# Altium project ESP32 S3_USB Dongle_V1.0.PrjPcb (part 3 of 3)
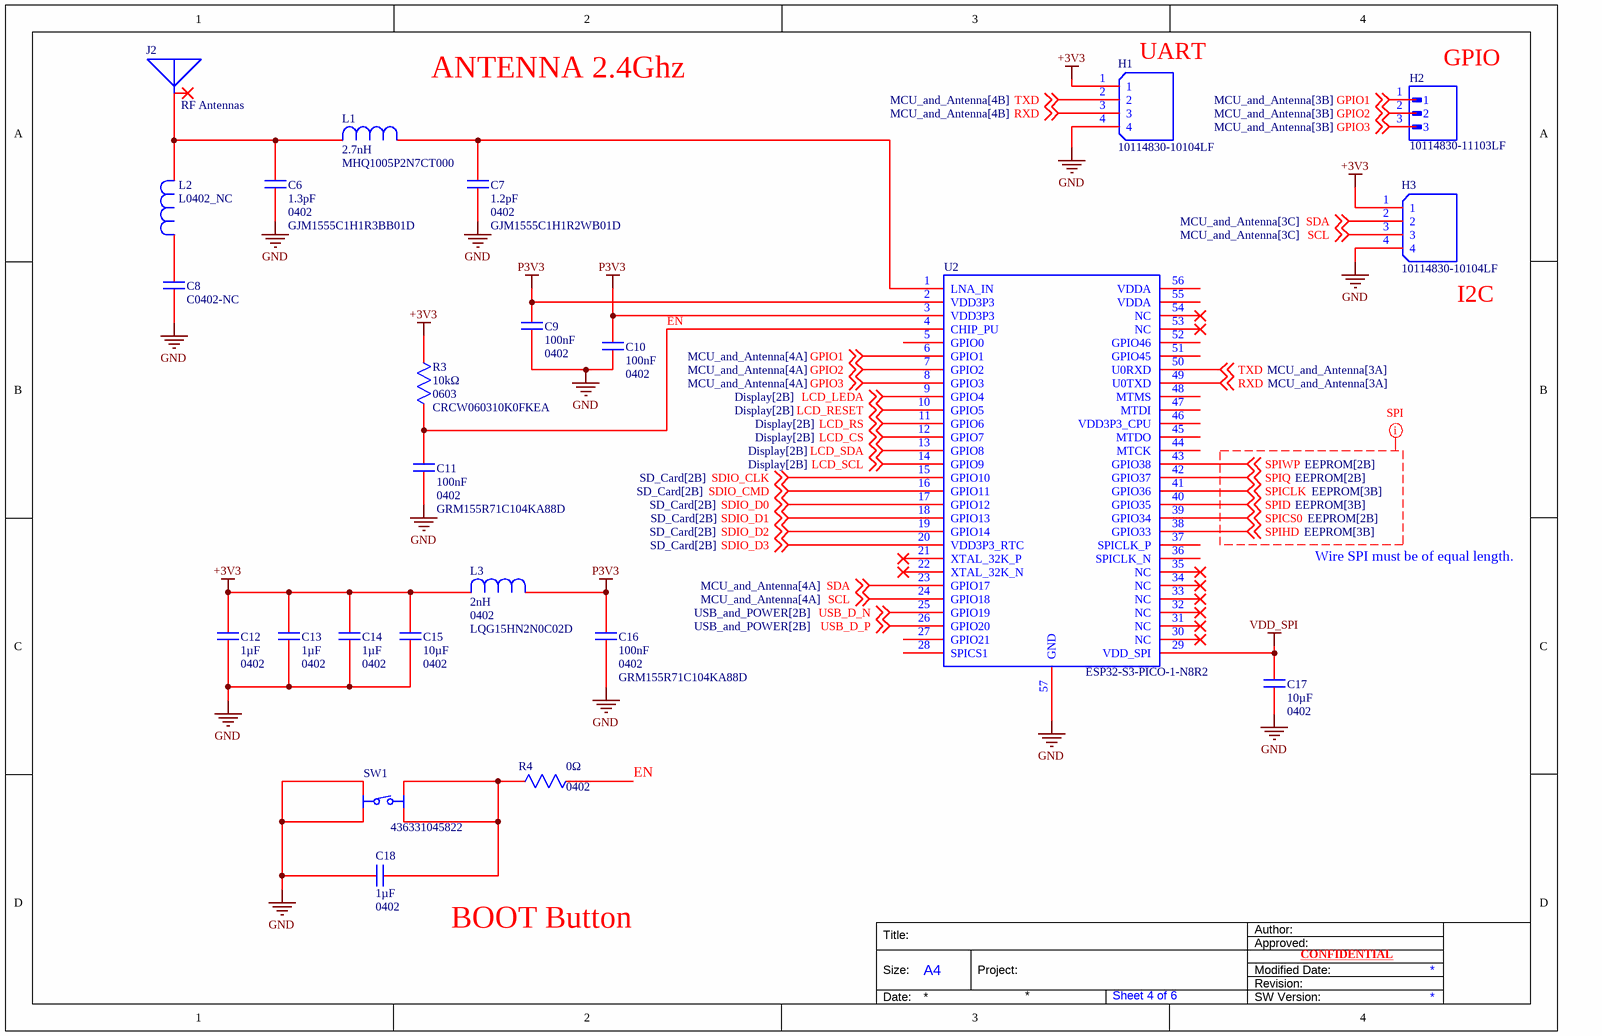
[diagram p6: MCU_and_Antenna.SchDoc]

## Sheet MCU_and_Antenna.SchDoc (continued)

### Library data of the parts (continued)
R3 = CRCW060310K0FKEA: Fixed Resistor, Metal Glaze/Thick Film, 0.1W, 10000ohm, 75V, 1% +/-Tol, Surface Mount, 0603; Manufacturer: Vishay; Max Power Dissipation: 100mW; Temperature Coefficient: 100ppm/°C; Supplier: DigiKey; Supplier Part Number: 541-10.0KHCT-ND; Manufacturer Part Number: CRCW060310K0FKEA; RoHS: Compliant; Category: Chip SMD Resistors; Stock: 5381974; Pricing: 1=0,1, 10=0,032, 25=0,024, 50=0,0194, 100=0,0158, 250=0,0124, 500=0,01046, 1000=0,00893 (USD); Case/Package: 0603; China RoHS: Non-Compliant; Composition: Thick Film; Contact Plating: Lead, Tin; Country of Origin: Israel, Taiwan; Depth: 850µm; Export Control Classification Number (ECCN) Code: EAR99; Features: Automotive AEC-Q200; Height: 450µm; Harmonized Tariff Schedule (HTS) Code: 8533.21.00.30; Introduction Date: 2005-02-16; Lead Free: Lead Free; Length: 1.55mm; Lifecycle Status: Production; Max Operating Temperature: 155°C; Military Standard: Not; Min Operating Temperature: -55°C; Mounting Technology: Surface Mount; Pins: 2; Number of Terminals: 2; Number of Terminations: 2; Packaging: Tape and Reel; Power Rating: 100mW; Radiation Hardening: No; Ratings: AEC-Q200; REACH SVHC: Yes; Schedule B: 8533210045, 8533210045|8533210045|8533210045|8533210045|8533210045|8533210045|8533210045|8533210045|8533210045|8533210045|8533210045|8533210045|8533210045|8533210045|8533210045|8533210045|8533210045|8533210045|8533210045|8533210045|8533210045|8533210045|8533210045|85; Termination: SMD/SMT; Tolerance: 1%; Voltage Rating: 75V; Voltage Rating (DC): 75V; Weight: 2.012816mg; Width: 850µm; Working Voltage: 75V; ComponentLink1URL: https://datasheet.octopart.com:443/CRCW060310K0FKEA-Vishay-datasheet-175423584.pdf?src-supplier=IHS; ComponentLink1Description: https://datasheet.octopart.com:443/CRCW060310K0FKEA-Vishay-datasheet-175423584.pdf?src-supplier=IHS; ComponentLink2URL: https://datasheet.octopart.com:443/CRCW060310K0FKEA-Vishay-datasheet-5300368.pdf?src-supplier=Future+Electronics; ComponentLink2Description: https://datasheet.octopart.com:443/CRCW060310K0FKEA-Vishay-datasheet-5300368.pdf?src-supplier=Future+Electronics; ComponentLink3URL: https://datasheet.octopart.com:443/CRCW060310K0FKEA-Vishay-datasheet-62316122.pdf?src-supplier=Future+Electronics; ComponentLink3Description: https://datasheet.octopart.com:443/CRCW060310K0FKEA-Vishay-datasheet-62316122.pdf?src-supplier=Future+Electronics; ComponentLink4URL: https://datasheet.octopart.com:443/CRCW060310K0FKEA-Vishay-datasheet-141434677.pdf?src-supplier=Upverter; ComponentLink4Description: https://datasheet.octopart.com:443/CRCW060310K0FKEA-Vishay-datasheet-141434677.pdf?src-supplier=Upverter; ComponentLink5URL: https://datasheet.octopart.com:443/CRCW060310K0FKEA-Vishay-datasheet-83961561.pdf?src-supplier=Newark; ComponentLink5Description: https://datasheet.octopart.com:443/CRCW060310K0FKEA-Vishay-datasheet-83961561.pdf?src-supplier=Newark; ComponentLink6URL: https://datasheet.octopart.com:443/CRCW060310K0FKEA-Vishay-datasheet-14722531.pdf?src-supplier=Newark; ComponentLink6Description: https://datasheet.octopart.com:443/CRCW060310K0FKEA-Vishay-datasheet-14722531.pdf?src-supplier=Newark; ComponentLink7URL: https://datasheet.octopart.com:443/CRCW060310K0FKEA-Vishay-datasheet-11516975.pdf?src-supplier=Newark; ComponentLink7Description: https://datasheet.octopart.com:443/CRCW060310K0FKEA-Vishay-datasheet-11516975.pdf?src-supplier=Newark; ComponentLink8URL: https://datasheet.octopart.com:443/CRCW060310K0FKEA-Vishay-datasheet-41302739.pdf?src-supplier=Newark; ComponentLink8Description: https://datasheet.octopart.com:443/CRCW060310K0FKEA-Vishay-datasheet-41302739.pdf?src-supplier=Newark; ComponentLink9URL: https://datasheet.octopart.com:443/CRCW060310K0FKEA-Vishay-datasheet-33013972.pdf?src-supplier=Newark; ComponentLink9Description: https://datasheet.octopart.com:443/CRCW060310K0FKEA-Vishay-datasheet-33013972.pdf?src-supplier=Newark; ComponentLink10URL: https://datasheet.octopart.com:443/CRCW060310K0FKEA-Vishay-datasheet-21226360.pdf?src-supplier=Newark; ComponentLink10Description: https://datasheet.octopart.com:443/CRCW060310K0FKEA-Vishay-datasheet-21226360.pdf?src-supplier=Newark; ComponentLink11URL: https://datasheet.octopart.com:443/CRCW060310K0FKEA-Vishay-datasheet-62317933.pdf?src-supplier=element14+APAC; ComponentLink11Description: https://datasheet.octopart.com:443/CRCW060310K0FKEA-Vishay-datasheet-62317933.pdf?src-supplier=element14+APAC; ComponentLink12URL: https://datasheet.octopart.com:443/CRCW060310K0FKEA-Vishay-datasheet-16179825.pdf?src-supplier=element14+APAC; ComponentLink12Description: https://datasheet.octopart.com:443/CRCW060310K0FKEA-Vishay-datasheet-16179825.pdf?src-supplier=element14+APAC; ComponentLink13URL: https://datasheet.octopart.com:443/CRCW060310K0FKEA-Vishay-datasheet-66077789.pdf?src-supplier=element14+APAC; ComponentLink13Description: https://datasheet.octopart.com:443/CRCW060310K0FKEA-Vishay-datasheet-66077789.pdf?src-supplier=element14+APAC; ComponentLink14URL: https://datasheet.octopart.com:443/CRCW060310K0FKEA-Vishay-datasheet-5306405.pdf?src-supplier=RS+(Formerly+Allied+Electronics); ComponentLink14Description: https://datasheet.octopart.com:443/CRCW060310K0FKEA-Vishay-datasheet-5306405.pdf?src-supplier=RS+(Formerly+Allied+Electronics); ComponentLink15URL: https://datasheet.octopart.com:443/CRCW060310K0FKEA-Vishay-Dale-datasheet-47688880.pdf?src-supplier=RS+(Formerly+Allied+Electronics); ComponentLink15Description: https://datasheet.octopart.com:443/CRCW060310K0FKEA-Vishay-Dale-datasheet-47688880.pdf?src-supplier=RS+(Formerly+Allied+Electronics); ComponentLink16URL: https://datasheet.octopart.com:443/CRCW060310K0FKEA-Vishay-datasheet-12001583.pdf?src-supplier=RS+(Formerly+Allied+Electronics); ComponentLink16Description: https://datasheet.octopart.com:443/CRCW060310K0FKEA-Vishay-datasheet-12001583.pdf?src-supplier=RS+(Formerly+Allied+Electronics); ComponentLink17URL: https://datasheet.octopart.com:443/CRCW060310K0FKEA-Vishay-datasheet-17834126.pdf?src-supplier=TME; ComponentLink17Description: https://datasheet.octopart.com:443/CRCW060310K0FKEA-Vishay-datasheet-17834126.pdf?src-supplier=TME; ComponentLink18URL: https://datasheet.octopart.com/D-CRCW-e3-Standard-Thick-Film-Chip-Resistors-Vishay-datasheet-family-64.pdf; ComponentLink18Description: https://datasheet.octopart.com/D-CRCW-e3-Standard-Thick-Film-Chip-Resistors-Vishay-datasheet-family-64.pdf; ComponentLink19URL: https://datasheet.octopart.com:443/CRCW060310K0FKEA-Vishay-datasheet-13242068.pdf?src-supplier=Farnell; ComponentLink19Description: https://datasheet.octopart.com:443/CRCW060310K0FKEA-Vishay-datasheet-13242068.pdf?src-supplier=Farnell; ComponentLink20URL: https://datasheet.octopart.com:443/CRCW060310K0FKEA-Vishay-datasheet-13195083.pdf?src-supplier=Farnell; ComponentLink20Description: https://datasheet.octopart.com:443/CRCW060310K0FKEA-Vishay-datasheet-13195083.pdf?src-supplier=Farnell; ComponentLink21URL: https://datasheet.octopart.com:443/CRCW060310K0FKEA-Vishay-datasheet-13034211.pdf?src-supplier=Farnell; ComponentLink21Description: https://datasheet.octopart.com:443/CRCW060310K0FKEA-Vishay-datasheet-13034211.pdf?src-supplier=Farnell; ComponentLink22URL: https://datasheet.octopart.com:443/CRCW060310K0FKEA-Vishay-datasheet-12600034.pdf?src-supplier=Farnell; ComponentLink22Description: https://datasheet.octopart.com:443/CRCW060310K0FKEA-Vishay-datasheet-12600034.pdf?src-supplier=Farnell; ComponentLink23URL: https://datasheet.octopart.com:443/CRCW060310K0FKEA-Vishay-datasheet-12532161.pdf?src-supplier=Farnell; ComponentLink23Description: https://datasheet.octopart.com:443/CRCW060310K0FKEA-Vishay-datasheet-12532161.pdf?src-supplier=Farnell; ComponentLink24URL: https://datasheet.octopart.com:443/CRCW060310K0FKEA-Vishay-datasheet-12517896.pdf?src-supplier=Farnell; ComponentLink24Description: https://datasheet.octopart.com:443/CRCW060310K0FKEA-Vishay-datasheet-12517896.pdf?src-supplier=Farnell; ComponentLink25URL: https://datasheet.octopart.com:443/CRCW060310K0FKEA-Vishay-datasheet-12509762.pdf?src-supplier=Farnell; ComponentLink25Description: https://datasheet.octopart.com:443/CRCW060310K0FKEA-Vishay-datasheet-12509762.pdf?src-supplier=Farnell; ComponentLink26URL: https://datasheet.octopart.com:443/CRCW060310K0FKEA-Vishay-datasheet-10322335.pdf?src-supplier=Farnell; ComponentLink26Description: https://datasheet.octopart.com:443/CRCW060310K0FKEA-Vishay-datasheet-10322335.pdf?src-supplier=Farnell; ComponentLink27URL: https://datasheet.octopart.com:443/CRCW060310K0FKEA-Vishay-datasheet-8788789.pdf?src-supplier=Farnell; ComponentLink27Description: https://datasheet.octopart.com:443/CRCW060310K0FKEA-Vishay-datasheet-8788789.pdf?src-supplier=Farnell; ComponentLink28URL: https://datasheet.octopart.com:443/CRCW060310K0FKEA-Vishay-datasheet-8361388.pdf?src-supplier=Farnell; ComponentLink28Description: https://datasheet.octopart.com:443/CRCW060310K0FKEA-Vishay-datasheet-8361388.pdf?src-supplier=Farnell; ComponentLink29URL: https://datasheet.octopart.com:443/CRCW060310K0FKEA-Vishay-datasheet-546287.pdf?src-supplier=Farnell; ComponentLink29Description: https://datasheet.octopart.com:443/CRCW060310K0FKEA-Vishay-datasheet-546287.pdf?src-supplier=Farnell; ComponentLink30URL: https://datasheet.octopart.com:443/CRCW060310K0FKEA-Vishay-datasheet-8619608.pdf?src-supplier=element14; ComponentLink30Description: https://datasheet.octopart.com:443/CRCW060310K0FKEA-Vishay-datasheet-8619608.pdf?src-supplier=element14; ComponentLink31URL: https://datasheet.octopart.com:443/CRCW060310K0FKEA-Vishay-datasheet-5377433.pdf?src-supplier=Garrett; ComponentLink31Description: https://datasheet.octopart.com:443/CRCW060310K0FKEA-Vishay-datasheet-5377433.pdf?src-supplier=Garrett; ComponentLink32URL: https://datasheet.octopart.com:443/CRCW060310K0FKEA-Vishay-datasheet-148188.pdf?src-supplier=Garrett; ComponentLink32Description: https://datasheet.octopart.com:443/CRCW060310K0FKEA-Vishay-datasheet-148188.pdf?src-supplier=Garrett; ComponentLink33URL: https://datasheet.octopart.com:443/CRCW060310K0FKEA-Vishay-datasheet-30224.pdf?src-supplier=Garrett; ComponentLink33Description: https://datasheet.octopart.com:443/CRCW060310K0FKEA-Vishay-datasheet-30224.pdf?src-supplier=Garrett; ComponentLink34URL: https://datasheet.octopart.com:443/CRCW060310K0FKEA-Vishay-datasheet-11835177.pdf?src-supplier=Arrow+Electronics; ComponentLink34Description: https://datasheet.octopart.com:443/CRCW060310K0FKEA-Vishay-datasheet-11835177.pdf?src-supplier=Arrow+Electronics; ComponentLink35URL: http://sigma.octopart.com:80/rohs_certificate/D-CRCW-e3-Standard-Thick-Film-Chip-Resistors-Vishay-family-102.pdf?src-supplier=Compliance+Statements; ComponentLink35Description: http://sigma.octopart.com:80/rohs_certificate/D-CRCW-e3-Standard-Thick-Film-Chip-Resistors-Vishay-family-102.pdf?src-supplier=Compliance+Statements; LCSC Part: C844918
R4 = RC0402JR-070RL: GENERAL PURPOSE CHIP RESISTOR Metal Glaze/thick Film, 0.0625W, 0ohm, Surface Mount, 0402; Manufacturer: Yageo Group; Max Power Dissipation: 63mW; Power Rating: 62.5mW; Temperature Coefficient: 200ppm/°C; Tolerance: 5%; Voltage Rating: 50V; Supplier: DigiKey; Supplier Part Number: 311-0.0JRDKR-ND; Manufacturer Part Number: RC0402JR-070RL; RoHS: Compliant; Category: Chip SMD Resistors; Stock: 12719023; Pricing: 1=0,1, 10=0,010, 25=0,0064, 50=0,0056, 100=0,0048, 250=0,00404, 500=0,00356, 1000=0,00313, 5000=0,00237 (USD); Case Code (Imperial): 0402; China RoHS: Non-Compliant; Composition: Thick Film; Contact Plating: Tin; Depth: 500µm; Features: Moisture Resistant; Height: 350µm; Lead Free: Lead Free; Length: 1mm; Lifecycle Status: Production; Max Operating Temperature: 155°C; Military Standard: Not; Min Operating Temperature: -55°C; Mounting Technology: Surface Mount; Pins: 2; Number of Terminals: 2; Number of Terminations: 2; Packaging: Tape & Reel; Radiation Hardening: No; REACH SVHC: Yes; Schedule B: 8533290000, 8533290000|8533290000, 8533290000|8533290000|8533290000, 8533290000|8533290000|8533290000|8533290000; Termination: SMD/SMT; Voltage Rating (DC): 50V; Width: 500µm; ComponentLink1URL: https://datasheet.octopart.com:443/RC0402JR-070RL-Yageo-datasheet-182189538.pdf?src-supplier=IHS; ComponentLink1Description: https://datasheet.octopart.com:443/RC0402JR-070RL-Yageo-datasheet-182189538.pdf?src-supplier=IHS; ComponentLink2URL: https://datasheet.octopart.com:443/RC0402JR-070RL-Yageo-datasheet-10408619.pdf?src-supplier=Newark; ComponentLink2Description: https://datasheet.octopart.com:443/RC0402JR-070RL-Yageo-datasheet-10408619.pdf?src-supplier=Newark; ComponentLink3URL: https://datasheet.octopart.com:443/RC0402JR-070RL-Yageo-Group-datasheet-181964826.pdf?src-supplier=Newark; ComponentLink3Description: https://datasheet.octopart.com:443/RC0402JR-070RL-Yageo-Group-datasheet-181964826.pdf?src-supplier=Newark; ComponentLink4URL: https://datasheet.octopart.com:443/RC0402JR-070RL-Yageo-Group-datasheet-190305687.pdf?src-supplier=Future+Electronics; ComponentLink4Description: https://datasheet.octopart.com:443/RC0402JR-070RL-Yageo-Group-datasheet-190305687.pdf?src-supplier=Future+Electronics; ComponentLink5URL: https://datasheet.octopart.com:443/RC0402JR-070RL-Yageo-datasheet-164759695.pdf?src-supplier=Future+Electronics; ComponentLink5Description: https://datasheet.octopart.com:443/RC0402JR-070RL-Yageo-datasheet-164759695.pdf?src-supplier=Future+Electronics; ComponentLink6URL: https://datasheet.octopart.com:443/RC0402JR-070RL-Yageo-datasheet-137700087.pdf?src-supplier=Future+Electronics; ComponentLink6Description: https://datasheet.octopart.com:443/RC0402JR-070RL-Yageo-datasheet-137700087.pdf?src-supplier=Future+Electronics; ComponentLink7URL: https://datasheet.octopart.com:443/RC0402JR-070RL-Yageo-datasheet-12531192.pdf?src-supplier=Seeed+Studio; ComponentLink7Description: https://datasheet.octopart.com:443/RC0402JR-070RL-Yageo-datasheet-12531192.pdf?src-supplier=Seeed+Studio; ComponentLink8URL: https://datasheet.octopart.com:443/RC0402JR-070RL-Yageo-datasheet-8324527.pdf?src-supplier=TME; ComponentLink8Description: https://datasheet.octopart.com:443/RC0402JR-070RL-Yageo-datasheet-8324527.pdf?src-supplier=TME; ComponentLink9URL: https://datasheet.octopart.com:443/RC0402JR-070RL-Yageo-datasheet-62067350.pdf?src-supplier=Farnell; ComponentLink9Description: https://datasheet.octopart.com:443/RC0402JR-070RL-Yageo-datasheet-62067350.pdf?src-supplier=Farnell; ComponentLink10URL: https://datasheet.octopart.com:443/RC0402JR-070RL-Yageo-datasheet-8329306.pdf?src-supplier=element14; ComponentLink10Description: https://datasheet.octopart.com:443/RC0402JR-070RL-Yageo-datasheet-8329306.pdf?src-supplier=element14; ComponentLink11URL: https://datasheet.octopart.com:443/RC0402JR-070RL-Yageo-datasheet-505231.pdf?src-supplier=element14; ComponentLink11Description: https://datasheet.octopart.com:443/RC0402JR-070RL-Yageo-datasheet-505231.pdf?src-supplier=element14; ComponentLink12URL: https://datasheet.octopart.com:443/RC0402JR-070RL-Yageo-datasheet-175423674.pdf?src-supplier=SOS+electronic; ComponentLink12Description: https://datasheet.octopart.com:443/RC0402JR-070RL-Yageo-datasheet-175423674.pdf?src-supplier=SOS+electronic; ComponentLink13URL: https://datasheet.octopart.com/RC0402JR-070RL-Yageo-datasheet-73766026.pdf; ComponentLink13Description: https://datasheet.octopart.com/RC0402JR-070RL-Yageo-datasheet-73766026.pdf; ComponentLink14URL: http://sigma.octopart.com:80/conflict_mineral_statement/Yageo-company-3.pdf?src-supplier=Compliance+Statements; ComponentLink14Description: http://sigma.octopart.com:80/conflict_mineral_statement/Yageo-company-3.pdf?src-supplier=Compliance+Statements; ComponentLink15URL: http://sigma.octopart.com:80/rohs_statement/Yageo-company-2.pdf?src-supplier=Compliance+Statements; ComponentLink15Description: http://sigma.octopart.com:80/rohs_statement/Yageo-company-2.pdf?src-supplier=Compliance+Statements; LCSC Part: C60485
SW1 = 436331045822: Wurth Elektronik tactile switch, Solder terminal, size 4.5 x 4.7mm, surface, SPST; Manufacturer Lifecycle Status: ACTIVE; Contact Current Rating: 50mA; Contact Resistance: 100mΩ; Life (Cycles): 100kcycles; Voltage Rating: 12V; YEOL: 1 = Estimated lifetime > 10 years; Supplier: DigiKey; Supplier Part Number: 732-7059-2-ND; Manufacturer: Wurth Elektronik; Manufacturer Part Number: 436331045822; RoHS: Compliant; Category: Tactile Switches; Stock: 30789; Pricing: 3300=0,32965 (USD); Contact Plating: Silver; Current Rating: 50mA; Height: 1.65mm; Insulation Resistance: 100MΩ; Lifecycle Status: Production; Max Operating Temperature: 85°C; Min Operating Temperature: -40°C; Mounting Technology: Surface Mount; Packaging: Tape and Reel; Voltage Rating (DC): 12V; Width: 4.7mm; ComponentLink1URL: https://datasheet.octopart.com:443/436331045822-W%C3%BCrth-Elektronik-datasheet-154248855.pdf?src-supplier=Wurth+Elektronik; ComponentLink1Description: https://datasheet.octopart.com:443/436331045822-W%C3%BCrth-Elektronik-datasheet-154248855.pdf?src-supplier=Wurth+Elektronik; ComponentLink2URL: https://datasheet.octopart.com:443/436331045822-W%C3%BCrth-Elektronik-datasheet-141445726.pdf?src-supplier=HQonline; ComponentLink2Description: https://datasheet.octopart.com:443/436331045822-W%C3%BCrth-Elektronik-datasheet-141445726.pdf?src-supplier=HQonline; ComponentLink3URL: https://datasheet.octopart.com:443/436331045822-W%C3%BCrth-Elektronik-Midcom-datasheet-10030364.pdf?src-supplier=element14+APAC; ComponentLink3Description: https://datasheet.octopart.com:443/436331045822-W%C3%BCrth-Elektronik-Midcom-datasheet-10030364.pdf?src-supplier=element14+APAC; ComponentLink4URL: https://datasheet.octopart.com:443/436331045822-W%C3%BCrth-Elektronik-datasheet-41196550.pdf?src-supplier=element14+APAC; ComponentLink4Description: https://datasheet.octopart.com:443/436331045822-W%C3%BCrth-Elektronik-datasheet-41196550.pdf?src-supplier=element14+APAC; LCSC Part: C5143619
U2 = ESP32-S3-PICO-1-N8R2: ESP32-S3-PICO-1 Is A System-in-p; Manufacturer: Espressif Systems; Supplier: DigiKey; Supplier Part Number: 1965-ESP32-S3-PICO-1-N8R2DKR-ND; Manufacturer Part Number: ESP32-S3-PICO-1-N8R2; Category: RF Transceiver Modules and Modems; Stock: 1099; Pricing: 1=6,1, 10=5,281, 25=4,9968, 100=4,6063, 250=4,37224, 500=4,20692, 1000=4,05122 (USD); LCSC Part: *

## Sheet Display.SchDoc
size A4; SheetNumber: 5; SheetTotal: 6
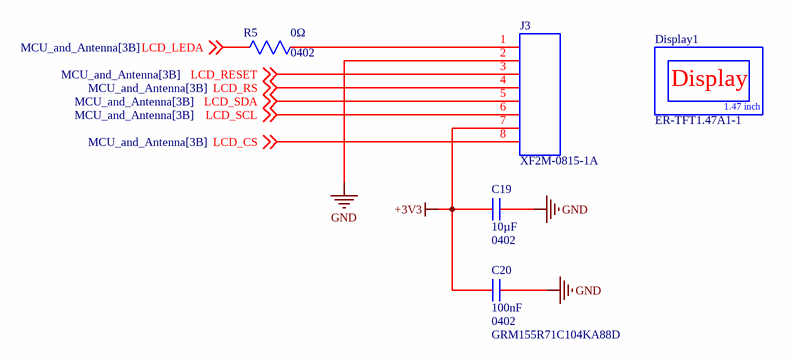
[diagram p2: Display.SchDoc]

### Parts
C19  value 10µF  Case/Package: 0402  [CAPC1005X55N]  (hidden comment: GRM155R60J106ME15D)
C20  GRM155R71C104KA88D  value 100nF  Case/Package: 0402  [CAPC1005X55N]
Display1  ER-TFT1.47A1-1  (mechanical)
J3  XF2M-0815-1A  [FPC connector 8pin, Pitch 0.5mm + Module_Display 1.14 inch]
R5  value 0Ω  Case/Package: 0402  [RC0402N_YAG-M]  (hidden comment: RC0402JR-070RL)

### Nets
+3V3: C19.2 C20.1 J3.7
GND: C19.1 C20.2 J3.2
LCD_CS: J3.8 ; off-sheet LCD_CS
LCD_LEDA: R5.1 ; off-sheet LCD_LEDA
LCD_RESET: J3.3 ; off-sheet LCD_RESET
LCD_RS: J3.4 ; off-sheet LCD_RS
LCD_SCL: J3.6 ; off-sheet LCD_SCL
LCD_SDA: J3.5 ; off-sheet LCD_SDA
NetJ3_1: J3.1 R5.2

### Notes on the sheet
- (in symbol ER-TFT1.47A1-1) Display; 1.47 inch

### Library data of the parts
C19 = GRM155R60J106ME15D: 6.3V 10uF X5R ±20% 0402 Multilayer Ceramic Capacitors MLCC - SMD/SMT ROHS; Manufacturer: Murata; Manufacturer Lifecycle Status: IN PRODUCTION; Supplier: DigiKey; Supplier Part Number: 490-13238-6-ND; Manufacturer Part Number: GRM155R60J106ME15D; RoHS: Compliant; Category: Ceramic Capacitors; Stock: 101484; Pricing: 1=0,16, 10=0,088, 50=0,0618, 100=0,0538, 500=0,04036, 1000=0,03624, 2500=0,0319, 5000=0,02929 (USD); Case Code (Imperial): 0402; Case Code (Metric): 1005; Dielectric: X5R; Dielectric Material: Ceramic; Height: 500µm; Length: 1mm; Lifecycle Status: Production; Material: Ceramic; Max Operating Temperature: 85°C; Min Operating Temperature: -55°C; Mounting Technology: Surface Mount; Number of Terminals: 2; REACH SVHC: Yes; Schedule B: 8532240020, 8532240020|8532240020, 8532240020|8532240020|8532240020, 8532240020|8532240020|8532240020|8532240020; Thickness: 500µm; Tolerance: 20%; Voltage Rating: 6.3V; Voltage Rating (DC): 6.3V; Width: 500µm; ComponentLink1URL: https://datasheet.octopart.com:443/GRM155R60J106ME15D-Murata-datasheet-149522992.pdf?src-supplier=Newark; ComponentLink1Description: https://datasheet.octopart.com:443/GRM155R60J106ME15D-Murata-datasheet-149522992.pdf?src-supplier=Newark; ComponentLink2URL: https://datasheet.octopart.com:443/GRM155R60J106ME15D-Murata-datasheet-165579666.pdf?src-supplier=TME; ComponentLink2Description: https://datasheet.octopart.com:443/GRM155R60J106ME15D-Murata-datasheet-165579666.pdf?src-supplier=TME; ComponentLink3URL: https://datasheet.octopart.com:443/GRM155R60J106ME15D-Murata-datasheet-141266224.pdf?src-supplier=Ciiva; ComponentLink3Description: https://datasheet.octopart.com:443/GRM155R60J106ME15D-Murata-datasheet-141266224.pdf?src-supplier=Ciiva; ComponentLink4URL: https://datasheet.octopart.com:443/GRM155R60J106ME15D-Murata-datasheet-140689297.pdf?src-supplier=Ciiva; ComponentLink4Description: https://datasheet.octopart.com:443/GRM155R60J106ME15D-Murata-datasheet-140689297.pdf?src-supplier=Ciiva; ComponentLink5URL: https://datasheet.octopart.com:443/GRM155R60J106ME15D-Murata-datasheet-138740639.pdf?src-supplier=Ciiva; ComponentLink5Description: https://datasheet.octopart.com:443/GRM155R60J106ME15D-Murata-datasheet-138740639.pdf?src-supplier=Ciiva; ComponentLink6URL: https://datasheet.octopart.com:443/GRM155R60J106ME15D-Murata-datasheet-102370999.pdf?src-supplier=HQonline; ComponentLink6Description: https://datasheet.octopart.com:443/GRM155R60J106ME15D-Murata-datasheet-102370999.pdf?src-supplier=HQonline; ComponentLink7URL: https://datasheet.octopart.com/GRM155R60J106ME15D-Murata-datasheet-12515295.pdf; ComponentLink7Description: https://datasheet.octopart.com/GRM155R60J106ME15D-Murata-datasheet-12515295.pdf; ComponentLink8URL: https://datasheet.octopart.com/GRM155R60J106ME15D-Murata-datasheet-12510076.pdf; ComponentLink8Description: https://datasheet.octopart.com/GRM155R60J106ME15D-Murata-datasheet-12510076.pdf; ComponentLink9URL: https://datasheet.octopart.com/GRM155R60J106ME15D-Murata-datasheet-11978611.pdf; ComponentLink9Description: https://datasheet.octopart.com/GRM155R60J106ME15D-Murata-datasheet-11978611.pdf; ComponentLink10URL: https://datasheet.octopart.com/GRM155R60J106ME15D-Murata-datasheet-10025737.pdf; ComponentLink10Description: https://datasheet.octopart.com/GRM155R60J106ME15D-Murata-datasheet-10025737.pdf; ComponentLink11URL: https://datasheet.octopart.com/GRM155R60J106ME15D-Murata-datasheet-8819587.pdf; ComponentLink11Description: https://datasheet.octopart.com/GRM155R60J106ME15D-Murata-datasheet-8819587.pdf; ComponentLink12URL: http://sigma.octopart.com:80/reach_statement/Murata-company-16.pdf?src-supplier=Compliance+Statements; ComponentLink12Description: http://sigma.octopart.com:80/reach_statement/Murata-company-16.pdf?src-supplier=Compliance+Statements; LCSC Part: C412251
C20 = GRM155R71C104KA88D: 16V 100nF X7R ±10% 0402 Multilayer Ceramic Capacitors MLCC - SMD/SMT ROHS; Manufacturer: Murata; Manufacturer Lifecycle Status: NRND; Insulation Resistance: 10GΩ; Supplier: DigiKey; Supplier Part Number: 490-3261-1-ND; Manufacturer Part Number: GRM155R71C104KA88D; RoHS: Compliant; Category: Ceramic Capacitors; Stock: 10363582; Pricing: 1=0,1, 10=0,024, 50=0,0156, 100=0,0132, 500=0,00926, 1000=0,00805, 2500=0,00678, 5000=0,00602 (USD); Case Code (Imperial): 0402; Case Code (Metric): 1005; Country of Origin: Japan, Mainland China, Philippines, Singapore, Thailand; Depth: 500µm; Dielectric: X7R; Dielectric Material: Ceramic; Export Control Classification Number (ECCN) Code: EAR99; Height: 500µm; Harmonized Tariff Schedule (HTS) Code: 8532.24.00.20; Introduction Date: 2004-11-19; Lead Free: Lead Free; Length: 1mm; Lifecycle Status: NRND; Material: Ceramic; Max Operating Temperature: 125°C; Min Operating Temperature: -55°C; Mounting Technology: Surface Mount; Pins: 2; Number of Terminals: 2; Packaging: Cut Tape; Radiation Hardening: No; REACH SVHC: Yes; Schedule B: 8532240020, 8532240020|8532240020|8532240020|8532240020|8532240020|8532240020|8532240020|8532240020|8532240020|8532240020|8532240020|8532240020|8532240020, 8532240020|8532240020|8532240020|8532240020|8532240020|8532240020|8532240020|8532240020|8532240020|8532240020|8532240020|8532240020|8532240020|8532240020, 8532240020|8532240020|8532240020|8532240020|8532240020|8532240020|8532240020|8532240020|8532240020|8532240020|8532240020|8532240020|8532240020|8532240020|8532240020; Termination: SMD/SMT; Thickness: 500µm; Tolerance: 10%; Voltage: 16V; Voltage Rating: 16V; Voltage Rating (DC): 16V; Width: 500µm; ComponentLink1URL: https://datasheet.octopart.com:443/GRM155R71C104KA88D-Murata-datasheet-6387203.pdf?src-supplier=Upverter; ComponentLink1Description: https://datasheet.octopart.com:443/GRM155R71C104KA88D-Murata-datasheet-6387203.pdf?src-supplier=Upverter; ComponentLink2URL: https://datasheet.octopart.com:443/GRM155R71C104KA88D-Murata-datasheet-501912.pdf?src-supplier=Farnell; ComponentLink2Description: https://datasheet.octopart.com:443/GRM155R71C104KA88D-Murata-datasheet-501912.pdf?src-supplier=Farnell; ComponentLink3URL: https://datasheet.octopart.com:443/GRM155R71C104KA88D-Murata-datasheet-62320226.pdf?src-supplier=Farnell; ComponentLink3Description: https://datasheet.octopart.com:443/GRM155R71C104KA88D-Murata-datasheet-62320226.pdf?src-supplier=Farnell; ComponentLink4URL: https://datasheet.octopart.com:443/GRM155R71C104KA88D-Murata-datasheet-514334.pdf?src-supplier=Farnell; ComponentLink4Description: https://datasheet.octopart.com:443/GRM155R71C104KA88D-Murata-datasheet-514334.pdf?src-supplier=Farnell; ComponentLink5URL: https://datasheet.octopart.com:443/GRM155R71C104KA88D-Murata-datasheet-165579666.pdf?src-supplier=TME; ComponentLink5Description: https://datasheet.octopart.com:443/GRM155R71C104KA88D-Murata-datasheet-165579666.pdf?src-supplier=TME; ComponentLink6URL: https://datasheet.octopart.com:443/GRM155R71C104KA88D-Murata-datasheet-81455578.pdf?src-supplier=TME; ComponentLink6Description: https://datasheet.octopart.com:443/GRM155R71C104KA88D-Murata-datasheet-81455578.pdf?src-supplier=TME; ComponentLink7URL: https://datasheet.octopart.com:443/GRM155R71C104KA88D-Murata-datasheet-59876780.pdf?src-supplier=TME; ComponentLink7Description: https://datasheet.octopart.com:443/GRM155R71C104KA88D-Murata-datasheet-59876780.pdf?src-supplier=TME; ComponentLink8URL: https://datasheet.octopart.com:443/GRM155R71C104KA88D-Murata-datasheet-141266224.pdf?src-supplier=Ciiva; ComponentLink8Description: https://datasheet.octopart.com:443/GRM155R71C104KA88D-Murata-datasheet-141266224.pdf?src-supplier=Ciiva; ComponentLink9URL: https://datasheet.octopart.com:443/GRM155R71C104KA88D-Murata-datasheet-140690972.pdf?src-supplier=Ciiva; ComponentLink9Description: https://datasheet.octopart.com:443/GRM155R71C104KA88D-Murata-datasheet-140690972.pdf?src-supplier=Ciiva; ComponentLink10URL: https://datasheet.octopart.com:443/GRM155R71C104KA88D-Murata-datasheet-138740890.pdf?src-supplier=Ciiva; ComponentLink10Description: https://datasheet.octopart.com:443/GRM155R71C104KA88D-Murata-datasheet-138740890.pdf?src-supplier=Ciiva; ComponentLink11URL: https://datasheet.octopart.com:443/GRM155R71C104KA88D-Murata-datasheet-120101189.pdf?src-supplier=Megastar; ComponentLink11Description: https://datasheet.octopart.com:443/GRM155R71C104KA88D-Murata-datasheet-120101189.pdf?src-supplier=Megastar; ComponentLink12URL: https://datasheet.octopart.com:443/GRM155R71C104KA88D-Murata-datasheet-96971104.pdf?src-supplier=Future+Electronics; ComponentLink12Description: https://datasheet.octopart.com:443/GRM155R71C104KA88D-Murata-datasheet-96971104.pdf?src-supplier=Future+Electronics; ComponentLink13URL: https://datasheet.octopart.com:443/GRM155R71C104KA88D-Murata-datasheet-22122223.pdf?src-supplier=Future+Electronics; ComponentLink13Description: https://datasheet.octopart.com:443/GRM155R71C104KA88D-Murata-datasheet-22122223.pdf?src-supplier=Future+Electronics; ComponentLink14URL: https://datasheet.octopart.com:443/GRM155R71C104KA88D-Murata-datasheet-14400564.pdf?src-supplier=Future+Electronics; ComponentLink14Description: https://datasheet.octopart.com:443/GRM155R71C104KA88D-Murata-datasheet-14400564.pdf?src-supplier=Future+Electronics; ComponentLink15URL: https://datasheet.octopart.com:443/GRM155R71C104KA88D-Murata-datasheet-44106293.pdf?src-supplier=Future+Electronics; ComponentLink15Description: https://datasheet.octopart.com:443/GRM155R71C104KA88D-Murata-datasheet-44106293.pdf?src-supplier=Future+Electronics; ComponentLink16URL: https://datasheet.octopart.com/GRM155R71C104KA88D-Murata-datasheet-12515295.pdf; ComponentLink16Description: https://datasheet.octopart.com/GRM155R71C104KA88D-Murata-datasheet-12515295.pdf; ComponentLink17URL: https://datasheet.octopart.com/GRM155R71C104KA88D-Murata-datasheet-12510076.pdf; ComponentLink17Description: https://datasheet.octopart.com/GRM155R71C104KA88D-Murata-datasheet-12510076.pdf; ComponentLink18URL: https://datasheet.octopart.com/GRM155R71C104KA88D-Murata-datasheet-11978611.pdf; ComponentLink18Description: https://datasheet.octopart.com/GRM155R71C104KA88D-Murata-datasheet-11978611.pdf; ComponentLink19URL: https://datasheet.octopart.com/GRM155R71C104KA88D-Murata-datasheet-10025737.pdf; ComponentLink19Description: https://datasheet.octopart.com/GRM155R71C104KA88D-Murata-datasheet-10025737.pdf; ComponentLink20URL: https://datasheet.octopart.com/GRM155R71C104KA88D-Murata-datasheet-8819587.pdf; ComponentLink20Description: https://datasheet.octopart.com/GRM155R71C104KA88D-Murata-datasheet-8819587.pdf; ComponentLink21URL: https://datasheet.octopart.com/GRM155R71C104KA88D-Murata-datasheet-12555248.pdf; ComponentLink21Description: https://datasheet.octopart.com/GRM155R71C104KA88D-Murata-datasheet-12555248.pdf; ComponentLink22URL: https://datasheet.octopart.com:443/GRM155R71C104KA88D-Murata-datasheet-11864723.pdf?src-supplier=Arrow+Electronics; ComponentLink22Description: https://datasheet.octopart.com:443/GRM155R71C104KA88D-Murata-datasheet-11864723.pdf?src-supplier=Arrow+Electronics; ComponentLink23URL: https://datasheet.octopart.com:443/GRM155R71C104KA88D-Murata-datasheet-148211.pdf?src-supplier=Garrett; ComponentLink23Description: https://datasheet.octopart.com:443/GRM155R71C104KA88D-Murata-datasheet-148211.pdf?src-supplier=Garrett; ComponentLink24URL: https://datasheet.octopart.com:443/GRM155R71C104KA88D-Murata-datasheet-118811.pdf?src-supplier=DigiKey; ComponentLink24Description: https://datasheet.octopart.com:443/GRM155R71C104KA88D-Murata-datasheet-118811.pdf?src-supplier=DigiKey; ComponentLink25URL: https://datasheet.octopart.com:443/GRM155R71C104KA88D-Murata-datasheet-38265814.pdf?src-supplier=Newark; ComponentLink25Description: https://datasheet.octopart.com:443/GRM155R71C104KA88D-Murata-datasheet-38265814.pdf?src-supplier=Newark; ComponentLink26URL: http://sigma.octopart.com:80/reach_statement/Murata-company-16.pdf?src-supplier=Compliance+Statements; ComponentLink26Description: http://sigma.octopart.com:80/reach_statement/Murata-company-16.pdf?src-supplier=Compliance+Statements; LCSC Part: C71629
Display1 = ER-TFT1.47A1-1: 1.47 inch IPS TFT LCD Display 172x320 ST7789 Connector Type FPC; Interface: SPI; Resolution: 172x320 pixels; Brightness level: 600cd/m2; Driver: ST7789V; Link: https://www.buydisplay.com/ips-1-47-inch-tft-lcd-display-172x320-st7789?srsltid=AfmBOopYb5kgFHJx_JGE4rcxt3MZ71FTwb70rWIkjshiwtaaazWFqNax&__cf_chl_f_tk=GFdsK93oje94JbQyBuwHNKdbPmSxDleeO8fUUMCdhQ8-1783331335-1.0.1.1-IRihdDpgZmZPS66vjhg2DEm_jBuNsRbgkRriLDuPt_Q; Connctor type: FPC; Part number: ER-TFT1.47A1-1
J3 = XF2M-0815-1A: Conn FFC/FPC Connector SKT 8 POS 0.5mm Solder RA SMD Reel; Manufacturer: Omron Electronics Inc-EMC Div; Actuator Material: Liquid Crystal Polymer, Polymer; Contact Location: Side; Contact Resistance: 50mΩ; Current Rating: 500mA; Dielectric Material: Liquid Crystal Polymer; Gender: Receptacle; Insulation Resistance: 100MΩ; Max Voltage Rating (DC): 5.05kV; Number of Contacts: 8; Pitch: 508µm; Plating Thickness: 152.4nm; Voltage Rating: 50V; Wire/Cable Type: Flat Flex; Supplier: Digikey; Supplier Part Number: OR1109CT-ND; Manufacturer Part Number: XF2M-0815-1A; RoHS: Compliant; Category: Card Edge Connectors; Stock: 7488; Pricing: 1=1,33, 10=1,14, 50=1, 100=0,963, 1000=0,774, 10000=0,694 (USD); Ambient Temperature Range High: 85°C; Contact Material: Gold, Nickel; Contact Plating: Gold; Export Control Classification Number (ECCN) Code: EAR99; Flammability Rating: UL94 V-0; Height: 3.1mm; Housing Material: Polymer; Introduction Date: 2012-09-26; Lead Free: Lead Free; Lifecycle Status: Production; Max Current Rating: 500mA; Max Operating Temperature: 85°C; Min Operating Temperature: -30°C; Mounting Technology: Surface Mount; Number of Positions: 8; Number of Rows: 1; Orientation: Right Angle; Packaging: Tape & Reel (TR); REACH SVHC: Yes; Schedule B: 8536694040, 8536694040|8536694040|8536694040|8536694040|8536694040; Terminal Pitch: 508µm; Termination: Solder; Voltage Rating (AC): 50V; ComponentLink1URL: https://datasheet.octopart.com:443/XF2M-0815-1A-Omron-datasheet-67143946.pdf?src-supplier=Farnell; ComponentLink1Description: https://datasheet.octopart.com:443/XF2M-0815-1A-Omron-datasheet-67143946.pdf?src-supplier=Farnell; ComponentLink2URL: https://datasheet.octopart.com:443/XF2M-0815-1A-Omron-datasheet-48845614.pdf?src-supplier=element14+APAC; ComponentLink2Description: https://datasheet.octopart.com:443/XF2M-0815-1A-Omron-datasheet-48845614.pdf?src-supplier=element14+APAC; ComponentLink3URL: https://datasheet.octopart.com:443/XF2M-0815-1A-Omron-datasheet-21210793.pdf?src-supplier=Sager+Electronics; ComponentLink3Description: https://datasheet.octopart.com:443/XF2M-0815-1A-Omron-datasheet-21210793.pdf?src-supplier=Sager+Electronics; ComponentLink4URL: https://datasheet.octopart.com:443/XF2M-0815-1A-Omron-datasheet-150021820.pdf?src-supplier=Sager+Electronics; ComponentLink4Description: https://datasheet.octopart.com:443/XF2M-0815-1A-Omron-datasheet-150021820.pdf?src-supplier=Sager+Electronics; ComponentLink5URL: https://datasheet.octopart.com:443/XF2M-0815-1A-Omron-datasheet-140570497.pdf?src-supplier=Arrow.cn; ComponentLink5Description: https://datasheet.octopart.com:443/XF2M-0815-1A-Omron-datasheet-140570497.pdf?src-supplier=Arrow.cn; ComponentLink6URL: https://datasheet.octopart.com:443/XF2M-0815-1A-Omron-datasheet-17455137.pdf?src-supplier=Electro+Sonic; ComponentLink6Description: https://datasheet.octopart.com:443/XF2M-0815-1A-Omron-datasheet-17455137.pdf?src-supplier=Electro+Sonic; LCSC Part: C3195305
R5 = RC0402JR-070RL: as R4 on sheet MCU_and_Antenna; Supplier: DigiKey; Supplier Part Number: 311-0.0JRDKR-ND; Manufacturer Part Number: RC0402JR-070RL; RoHS: Compliant; Category: Chip SMD Resistors; Stock: 12719023; Pricing: 1=0,1, 10=0,010, 25=0,0064, 50=0,0056, 100=0,0048, 250=0,00404, 500=0,00356, 1000=0,00313, 5000=0,00237 (USD); Case Code (Imperial): 0402; China RoHS: Non-Compliant; Composition: Thick Film; Contact Plating: Tin; Depth: 500µm; Features: Moisture Resistant; Height: 350µm; Lead Free: Lead Free; Length: 1mm; Lifecycle Status: Production; Max Operating Temperature: 155°C; Military Standard: Not; Min Operating Temperature: -55°C; Mounting Technology: Surface Mount; Pins: 2; Number of Terminals: 2; Number of Terminations: 2; Packaging: Tape & Reel; Radiation Hardening: No; REACH SVHC: Yes; Schedule B: 8533290000, 8533290000|8533290000, 8533290000|8533290000|8533290000, 8533290000|8533290000|8533290000|8533290000; Termination: SMD/SMT; Voltage Rating (DC): 50V; Width: 500µm; ComponentLink1URL: https://datasheet.octopart.com:443/RC0402JR-070RL-Yageo-datasheet-182189538.pdf?src-supplier=IHS; ComponentLink1Description: https://datasheet.octopart.com:443/RC0402JR-070RL-Yageo-datasheet-182189538.pdf?src-supplier=IHS; ComponentLink2URL: https://datasheet.octopart.com:443/RC0402JR-070RL-Yageo-datasheet-10408619.pdf?src-supplier=Newark; ComponentLink2Description: https://datasheet.octopart.com:443/RC0402JR-070RL-Yageo-datasheet-10408619.pdf?src-supplier=Newark; ComponentLink3URL: https://datasheet.octopart.com:443/RC0402JR-070RL-Yageo-Group-datasheet-181964826.pdf?src-supplier=Newark; ComponentLink3Description: https://datasheet.octopart.com:443/RC0402JR-070RL-Yageo-Group-datasheet-181964826.pdf?src-supplier=Newark; ComponentLink4URL: https://datasheet.octopart.com:443/RC0402JR-070RL-Yageo-Group-datasheet-190305687.pdf?src-supplier=Future+Electronics; ComponentLink4Description: https://datasheet.octopart.com:443/RC0402JR-070RL-Yageo-Group-datasheet-190305687.pdf?src-supplier=Future+Electronics; ComponentLink5URL: https://datasheet.octopart.com:443/RC0402JR-070RL-Yageo-datasheet-164759695.pdf?src-supplier=Future+Electronics; ComponentLink5Description: https://datasheet.octopart.com:443/RC0402JR-070RL-Yageo-datasheet-164759695.pdf?src-supplier=Future+Electronics; ComponentLink6URL: https://datasheet.octopart.com:443/RC0402JR-070RL-Yageo-datasheet-137700087.pdf?src-supplier=Future+Electronics; ComponentLink6Description: https://datasheet.octopart.com:443/RC0402JR-070RL-Yageo-datasheet-137700087.pdf?src-supplier=Future+Electronics; ComponentLink7URL: https://datasheet.octopart.com:443/RC0402JR-070RL-Yageo-datasheet-12531192.pdf?src-supplier=Seeed+Studio; ComponentLink7Description: https://datasheet.octopart.com:443/RC0402JR-070RL-Yageo-datasheet-12531192.pdf?src-supplier=Seeed+Studio; ComponentLink8URL: https://datasheet.octopart.com:443/RC0402JR-070RL-Yageo-datasheet-8324527.pdf?src-supplier=TME; ComponentLink8Description: https://datasheet.octopart.com:443/RC0402JR-070RL-Yageo-datasheet-8324527.pdf?src-supplier=TME; ComponentLink9URL: https://datasheet.octopart.com:443/RC0402JR-070RL-Yageo-datasheet-62067350.pdf?src-supplier=Farnell; ComponentLink9Description: https://datasheet.octopart.com:443/RC0402JR-070RL-Yageo-datasheet-62067350.pdf?src-supplier=Farnell; ComponentLink10URL: https://datasheet.octopart.com:443/RC0402JR-070RL-Yageo-datasheet-8329306.pdf?src-supplier=element14; ComponentLink10Description: https://datasheet.octopart.com:443/RC0402JR-070RL-Yageo-datasheet-8329306.pdf?src-supplier=element14; ComponentLink11URL: https://datasheet.octopart.com:443/RC0402JR-070RL-Yageo-datasheet-505231.pdf?src-supplier=element14; ComponentLink11Description: https://datasheet.octopart.com:443/RC0402JR-070RL-Yageo-datasheet-505231.pdf?src-supplier=element14; ComponentLink12URL: https://datasheet.octopart.com:443/RC0402JR-070RL-Yageo-datasheet-175423674.pdf?src-supplier=SOS+electronic; ComponentLink12Description: https://datasheet.octopart.com:443/RC0402JR-070RL-Yageo-datasheet-175423674.pdf?src-supplier=SOS+electronic; ComponentLink13URL: https://datasheet.octopart.com/RC0402JR-070RL-Yageo-datasheet-73766026.pdf; ComponentLink13Description: https://datasheet.octopart.com/RC0402JR-070RL-Yageo-datasheet-73766026.pdf; ComponentLink14URL: http://sigma.octopart.com:80/conflict_mineral_statement/Yageo-company-3.pdf?src-supplier=Compliance+Statements; ComponentLink14Description: http://sigma.octopart.com:80/conflict_mineral_statement/Yageo-company-3.pdf?src-supplier=Compliance+Statements; ComponentLink15URL: http://sigma.octopart.com:80/rohs_statement/Yageo-company-2.pdf?src-supplier=Compliance+Statements; ComponentLink15Description: http://sigma.octopart.com:80/rohs_statement/Yageo-company-2.pdf?src-supplier=Compliance+Statements; LCSC Part: C60485

## Sheet EEPROM.SchDoc
size A4; SheetNumber: 6; SheetTotal: 6
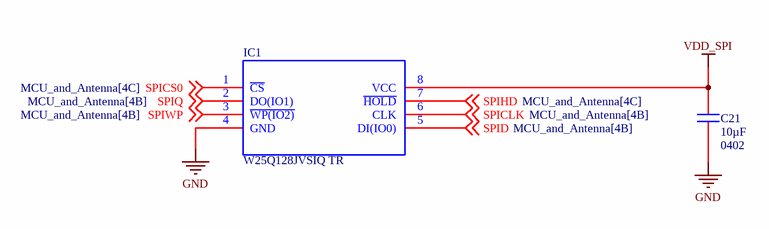
[diagram p3: EEPROM.SchDoc]

### Parts
C21  value 10µF  Case/Package: 0402  [CAPC1005X55N]  (hidden comment: GRM155R60J106ME15D)
IC1  W25Q128JVSIQ TR  [SOIC_208MIL_WIN-M]

### Nets
GND: C21.1 IC1.4(GND)
VDD_SPI: C21.2 IC1.8(VCC)
SPICLK: IC1.6(CLK) ; off-sheet SPICLK
SPICS0: IC1.1(~{CS}) ; off-sheet SPICS0
SPID: IC1.5(DI(IO0)) ; off-sheet SPID
SPIHD: IC1.7(~{HOLD}) ; off-sheet SPIHD
SPIQ: IC1.2(DO(IO1)) ; off-sheet SPIQ
SPIWP: IC1.3(~{WP(IO2)}) ; off-sheet SPIWP

### Library data of the parts
C21 = GRM155R60J106ME15D: as C19 on sheet Display; Supplier: DigiKey; Supplier Part Number: 490-13238-6-ND; Manufacturer Part Number: GRM155R60J106ME15D; RoHS: Compliant; Category: Ceramic Capacitors; Stock: 101484; Pricing: 1=0,16, 10=0,088, 50=0,0618, 100=0,0538, 500=0,04036, 1000=0,03624, 2500=0,0319, 5000=0,02929 (USD); Case Code (Imperial): 0402; Case Code (Metric): 1005; Dielectric: X5R; Dielectric Material: Ceramic; Height: 500µm; Length: 1mm; Lifecycle Status: Production; Material: Ceramic; Max Operating Temperature: 85°C; Min Operating Temperature: -55°C; Mounting Technology: Surface Mount; Number of Terminals: 2; REACH SVHC: Yes; Schedule B: 8532240020, 8532240020|8532240020, 8532240020|8532240020|8532240020, 8532240020|8532240020|8532240020|8532240020; Thickness: 500µm; Tolerance: 20%; Voltage Rating: 6.3V; Voltage Rating (DC): 6.3V; Width: 500µm; ComponentLink1URL: https://datasheet.octopart.com:443/GRM155R60J106ME15D-Murata-datasheet-149522992.pdf?src-supplier=Newark; ComponentLink1Description: https://datasheet.octopart.com:443/GRM155R60J106ME15D-Murata-datasheet-149522992.pdf?src-supplier=Newark; ComponentLink2URL: https://datasheet.octopart.com:443/GRM155R60J106ME15D-Murata-datasheet-165579666.pdf?src-supplier=TME; ComponentLink2Description: https://datasheet.octopart.com:443/GRM155R60J106ME15D-Murata-datasheet-165579666.pdf?src-supplier=TME; ComponentLink3URL: https://datasheet.octopart.com:443/GRM155R60J106ME15D-Murata-datasheet-141266224.pdf?src-supplier=Ciiva; ComponentLink3Description: https://datasheet.octopart.com:443/GRM155R60J106ME15D-Murata-datasheet-141266224.pdf?src-supplier=Ciiva; ComponentLink4URL: https://datasheet.octopart.com:443/GRM155R60J106ME15D-Murata-datasheet-140689297.pdf?src-supplier=Ciiva; ComponentLink4Description: https://datasheet.octopart.com:443/GRM155R60J106ME15D-Murata-datasheet-140689297.pdf?src-supplier=Ciiva; ComponentLink5URL: https://datasheet.octopart.com:443/GRM155R60J106ME15D-Murata-datasheet-138740639.pdf?src-supplier=Ciiva; ComponentLink5Description: https://datasheet.octopart.com:443/GRM155R60J106ME15D-Murata-datasheet-138740639.pdf?src-supplier=Ciiva; ComponentLink6URL: https://datasheet.octopart.com:443/GRM155R60J106ME15D-Murata-datasheet-102370999.pdf?src-supplier=HQonline; ComponentLink6Description: https://datasheet.octopart.com:443/GRM155R60J106ME15D-Murata-datasheet-102370999.pdf?src-supplier=HQonline; ComponentLink7URL: https://datasheet.octopart.com/GRM155R60J106ME15D-Murata-datasheet-12515295.pdf; ComponentLink7Description: https://datasheet.octopart.com/GRM155R60J106ME15D-Murata-datasheet-12515295.pdf; ComponentLink8URL: https://datasheet.octopart.com/GRM155R60J106ME15D-Murata-datasheet-12510076.pdf; ComponentLink8Description: https://datasheet.octopart.com/GRM155R60J106ME15D-Murata-datasheet-12510076.pdf; ComponentLink9URL: https://datasheet.octopart.com/GRM155R60J106ME15D-Murata-datasheet-11978611.pdf; ComponentLink9Description: https://datasheet.octopart.com/GRM155R60J106ME15D-Murata-datasheet-11978611.pdf; ComponentLink10URL: https://datasheet.octopart.com/GRM155R60J106ME15D-Murata-datasheet-10025737.pdf; ComponentLink10Description: https://datasheet.octopart.com/GRM155R60J106ME15D-Murata-datasheet-10025737.pdf; ComponentLink11URL: https://datasheet.octopart.com/GRM155R60J106ME15D-Murata-datasheet-8819587.pdf; ComponentLink11Description: https://datasheet.octopart.com/GRM155R60J106ME15D-Murata-datasheet-8819587.pdf; ComponentLink12URL: http://sigma.octopart.com:80/reach_statement/Murata-company-16.pdf?src-supplier=Compliance+Statements; ComponentLink12Description: http://sigma.octopart.com:80/reach_statement/Murata-company-16.pdf?src-supplier=Compliance+Statements; LCSC Part: C412251
IC1 = W25Q128JVSIQ TR: NOR Flash Serial (SPI, Dual SPI, Quad SPI) 3V/3.3V 128M-bit 16M x 8 6ns 8-Pin SOIC T/R; Manufacturer: Winbond; Frequency: 104MHz; Interface: SPI, Serial; Memory Format: FLASH, NOR; Supplier: DigiKey; Supplier Part Number: 256-W25Q128JVSIQTRCT-ND; Manufacturer Part Number: W25Q128JVSIQ TR; RoHS: Compliant; Category: Flash; Stock: 40140; Pricing: 1=3,72, 10=3,468, 25=3,3672, 50=3,29, 100=3,2127, 250=3,11104, 500=3,03472, 1000=2,95921 (USD); Case/Package: SOIC; Max Operating Temperature: 85°C; Min Operating Temperature: -40°C; Schedule B: 8542320070, 8542320070|8542320070, 8542320070|8542320070|8542320070, 8542320070|8542320070|8542320070|8542320070; ComponentLink1URL: https://datasheet.octopart.com:443/W25Q128JVSIQ-TR-Winbond-datasheet-138104337.pdf?src-supplier=Augswan; ComponentLink1Description: https://datasheet.octopart.com:443/W25Q128JVSIQ-TR-Winbond-datasheet-138104337.pdf?src-supplier=Augswan; LCSC Part: C97521

## Sheet SD_Card.SchDoc
size A4; SheetNumber: 7; SheetTotal: 6
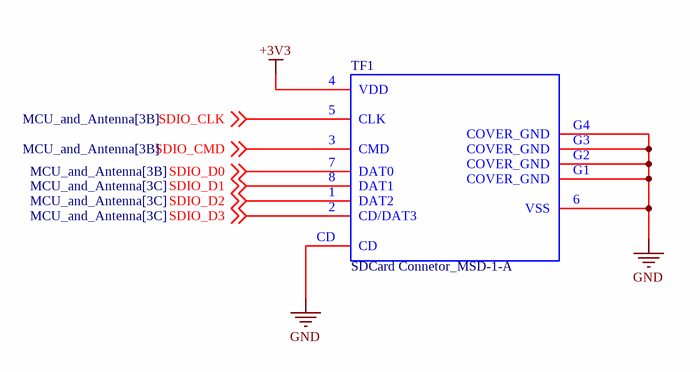
[diagram p4: SD_Card.SchDoc]

### Parts
TF1  SDCard Connetor_MSD-1-A  [CUI_MSD-1-A]

### Nets
+3V3: TF1.4(VDD)
GND: TF1.6(VSS) TF1.CD TF1.G1(COVER_GND) TF1.G2(COVER_GND) TF1.G3(COVER_GND) TF1.G4(COVER_GND)
SDIO_CLK: TF1.5(CLK) ; off-sheet SDIO_CLK
SDIO_CMD: TF1.3(CMD) ; off-sheet SDIO_CMD
SDIO_D0: TF1.7(DAT0) ; off-sheet SDIO_D0
SDIO_D1: TF1.8(DAT1) ; off-sheet SDIO_D1
SDIO_D2: TF1.1(DAT2) ; off-sheet SDIO_D2
SDIO_D3: TF1.2(CD/DAT3) ; off-sheet SDIO_D3

### Library data of the parts
TF1 = MSD-1-A: Card Connector, Micro Sd, Push In Auto Eject Out Rohs Compliant: Yes |Same Sky MSD-1-A; Number of Contacts: 9; Supplier: DigiKey; Supplier Part Number: 2223-MSD-1-ADKR-ND; Manufacturer: Same Sky; Manufacturer Part Number: MSD-1-A; RoHS: Compliant; Category: Card Edge Connectors; Stock: 22918; Pricing: 1=0,38, 10=0,337, 25=0,3212, 50=0,3096, 100=0,2985, 250=0,28452, 500=0,27438 (USD); Lifecycle Status: Production; Pins: 9; ComponentLink1URL: https://datasheet.octopart.com:443/MSD-1-A-Same-Sky-datasheet-188826037.pdf?src-supplier=Future+Electronics; ComponentLink1Description: https://datasheet.octopart.com:443/MSD-1-A-Same-Sky-datasheet-188826037.pdf?src-supplier=Future+Electronics; ComponentLink2URL: https://datasheet.octopart.com:443/MSD-1-A-Same-Sky-datasheet-181916823.pdf?src-supplier=Same+Sky; ComponentLink2Description: https://datasheet.octopart.com:443/MSD-1-A-Same-Sky-datasheet-181916823.pdf?src-supplier=Same+Sky; ComponentLink3URL: https://datasheet.octopart.com:443/MSD-1-A-Same-Sky-datasheet-187906752.pdf?src-supplier=Master+Electronics; ComponentLink3Description: https://datasheet.octopart.com:443/MSD-1-A-Same-Sky-datasheet-187906752.pdf?src-supplier=Master+Electronics; ComponentLink4URL: https://datasheet.octopart.com:443/MSD-1-A-Same-Sky-datasheet-189105030.pdf?src-supplier=Master+Electronics; ComponentLink4Description: https://datasheet.octopart.com:443/MSD-1-A-Same-Sky-datasheet-189105030.pdf?src-supplier=Master+Electronics; ComponentLink5URL: https://datasheet.octopart.com:443/MSD-1-A-Same-Sky-datasheet-192927133.pdf?src-supplier=Farnell; ComponentLink5Description: https://datasheet.octopart.com:443/MSD-1-A-Same-Sky-datasheet-192927133.pdf?src-supplier=Farnell; ComponentLink6URL: https://octopart.com:443/opatz8j6/c1?t=vp1p1RiQ7_bbECyTA0y4sfTKdNK0uxHJB4IJybVem8wfn_d81AkevM-28rbvRvGobWwflIHzG1kFMVOfj4kHg7XvkbfSCEJ7QJUOw8RagXeSWULw5ToeuFDdJR7Bt4vxDtry0ssBHcqByyX6VfftwN1L4faraza0AI-7RGbWMwA6F9LSqLt9_EMr0BxlEhXuXrshFT8wtW-WV5rQURwZJFG16ertrOprtftK68kM6a6LFeToBh8QSflZEyNvhx9JPCtmtoosfXqgwYVYCg7S3alAAaytfdeoLFI4QoT-ekVsdXkV83oacCLK0qWz3So_Qz_4GnTlkdSuyzdB_i-sEeuXWT3vb9ZdCw&src-supplier=Compliance+Statements; ComponentLink6Description: https://octopart.com:443/opatz8j6/c1?t=vp1p1RiQ7_bbECyTA0y4sfTKdNK0uxHJB4IJybVem8wfn_d81AkevM-28rbvRvGobWwflIHzG1kFMVOfj4kHg7XvkbfSCEJ7QJUOw8RagXeSWULw5ToeuFDdJR7Bt4vxDtry0ssBHcqByyX6VfftwN1L4faraza0AI-7RGbWMwA6F9LSqLt9_EMr0BxlEhXuXrshFT8wtW-WV5rQURwZJFG16ertrOprtftK68kM6a6LFeToBh8QSflZEyNvhx9JPCtmtoosfXqgwYVYCg7S3alAAaytfdeoLFI4QoT-ekVsdXkV83oacCLK0qWz3So_Qz_4GnTlkdSuyzdB_i-sEeuXWT3vb9ZdCw&src-supplier=Compliance+Statements; ComponentLink7URL: https://octopart.com:443/opatz8j6/c1?t=wAi6ISJASBnr8eO6lSjSIHP2me3m_9JM9t7W5VqSuSqxXYYJcLah3NUVD-7KOeeDFDGTRMzH8uuSVpkC-dK8fDh7z78_Zz7yIXmwbgIJI1qZCq7xwXiaEBLQXT6ZnDMy6rrDwlb80FwwLiQM50BkdkbR5EeE1LfLeWHnwravg99_jLWlkSIiScvx2zQpJINNM4l5hIZMqDUJfGPmTvGFOpba4p3TKJetJ1SK5RMzhW7EBLCMyaFc11RY6XyCtek_Rl1wWLfJ0x3653ljfiWvaBt52Rr3c_7yFcHOKK0ZDwbDeFPkBPIVfLA_uDjBt4Uz3XRATwQr3zhnt-anWoerKFWB3yJpHzj1KQ&src-supplier=Compliance+Statements; ComponentLink7Description: https://octopart.com:443/opatz8j6/c1?t=wAi6ISJASBnr8eO6lSjSIHP2me3m_9JM9t7W5VqSuSqxXYYJcLah3NUVD-7KOeeDFDGTRMzH8uuSVpkC-dK8fDh7z78_Zz7yIXmwbgIJI1qZCq7xwXiaEBLQXT6ZnDMy6rrDwlb80FwwLiQM50BkdkbR5EeE1LfLeWHnwravg99_jLWlkSIiScvx2zQpJINNM4l5hIZMqDUJfGPmTvGFOpba4p3TKJetJ1SK5RMzhW7EBLCMyaFc11RY6XyCtek_Rl1wWLfJ0x3653ljfiWvaBt52Rr3c_7yFcHOKK0ZDwbDeFPkBPIVfLA_uDjBt4Uz3XRATwQr3zhnt-anWoerKFWB3yJpHzj1KQ&src-supplier=Compliance+Statements; LCSC Part: C20619272

## Nets that join several sheets
+3V3: USB_and_POWER (C2.2 U1.5), MCU_and_Antenna (8 pins), Display (C19.2 C20.1 J3.7), SD_Card (TF1.4)
GND: USB_and_POWER (9 pins), MCU_and_Antenna (18 pins), Display (C19.1 C20.2 J3.2), EEPROM (C21.1 IC1.4), SD_Card (6 pins)
VDD_SPI: MCU_and_Antenna (C17.2 U2.29), EEPROM (C21.2 IC1.8)
LCD_CS: MCU_and_Antenna (U2.12), Display (J3.8)
LCD_LEDA: MCU_and_Antenna (U2.9), Display (R5.1)
LCD_RESET: MCU_and_Antenna (U2.10), Display (J3.3)
LCD_RS: MCU_and_Antenna (U2.11), Display (J3.4)
LCD_SCL: MCU_and_Antenna (U2.14), Display (J3.6)
LCD_SDA: MCU_and_Antenna (U2.13), Display (J3.5)
SDIO_CLK: MCU_and_Antenna (U2.15), SD_Card (TF1.5)
SDIO_CMD: MCU_and_Antenna (U2.16), SD_Card (TF1.3)
SDIO_D0: MCU_and_Antenna (U2.17), SD_Card (TF1.7)
SDIO_D1: MCU_and_Antenna (U2.18), SD_Card (TF1.8)
SDIO_D2: MCU_and_Antenna (U2.19), SD_Card (TF1.1)
SDIO_D3: MCU_and_Antenna (U2.20), SD_Card (TF1.2)
SPICLK: MCU_and_Antenna (U2.41), EEPROM (IC1.6)
SPICS0: MCU_and_Antenna (U2.39), EEPROM (IC1.1)
SPID: MCU_and_Antenna (U2.40), EEPROM (IC1.5)
SPIHD: MCU_and_Antenna (U2.38), EEPROM (IC1.7)
SPIQ: MCU_and_Antenna (U2.42), EEPROM (IC1.2)
SPIWP: MCU_and_Antenna (U2.43), EEPROM (IC1.3)
USB_D_N: USB_and_POWER (R1.2), MCU_and_Antenna (U2.25)
USB_D_P: USB_and_POWER (R2.2), MCU_and_Antenna (U2.26)